# Altium schematic sheet micromicroUSBuart.SchDoc: micromicroUSBuart
size A4; DrawnBy: ftg; Engineer: ftg; Organization: Bonk.Solutions; Revision: 0; DocumentName: micromicroUSBuart; ProjectName: micromicroUSBuart
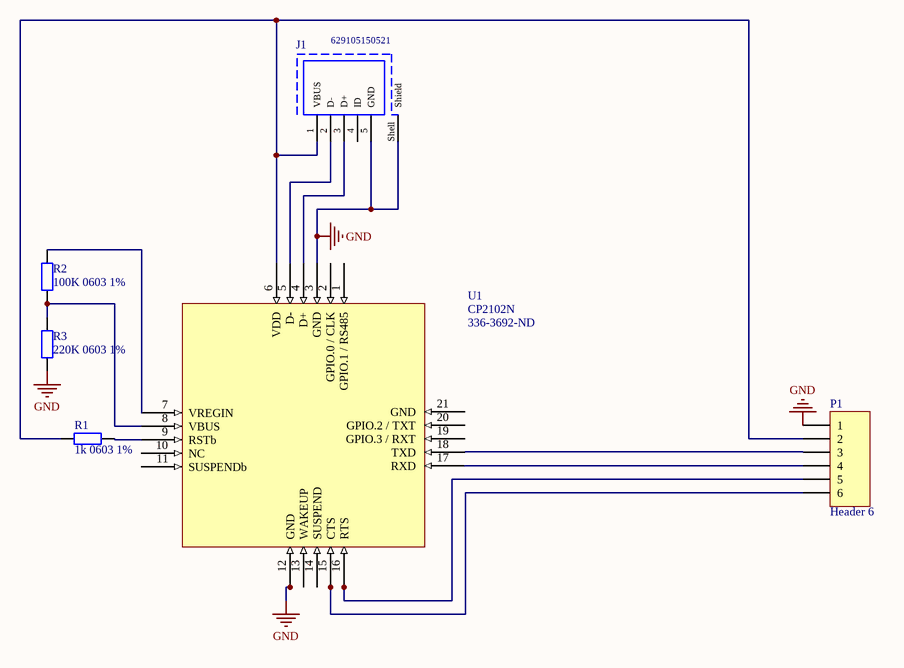
[diagram p0: micromicroUSBuart.SchDoc]

## Parts
J1  629105150521  [629105150521]
P1  Header 6  [HDR1X6]
R1  1k 0603 1%  [R0603]
R2  100K 0603 1%  [R0603]
R3  220K 0603 1%  [R0603]
U1  CP2102N  Supplier Part Number 1: 336-3692-ND  [QFN20_SILABS]

## Nets
GND: J1.5(GND) J1.Shell(Shield) P1.1 R3.1 U1.12(GND)
NetJ1_1: J1.1(VBUS) P1.2 R1.1
NetJ1_2: J1.2(D-) U1.5(D-)
NetJ1_3: J1.3(D+) U1.4(D+)
NetP1_5: P1.5 U1.16(RTS)
NetP1_6: P1.6 U1.15(CTS)
NetR2_1: R2.1 R3.2

Not connected (* = marked no-connect by the designer): J1 4(ID); P1 3 4; R1 2; R2 2; U1 1(GPIO.1_/_RS485) 2(GPIO.0_/_CLK) 3(GND) 6(VDD) 7(VREGIN) 8(VBUS) 9(RSTb) 10(NC) 11(SUSPENDb) 13(WAKEUP) 14(SUSPEND) 17(RXD) 18(TXD) 19(GPIO.3_/_RXT) 20(GPIO.2_/_TXT) 21(GND)

## Library data of the parts
J1 = 629105150521: Micro USB 2.0 Type B Receptacle WR-COM, Horizontal, SMT, with Pegs, High Current at Pin 1 & Pin 5; Rated Current: 3 A; Contact Resistance: 30 mOhm; Working Voltage: 30 VAC; ComponentLink1Description: Manufacturer; ComponentLink1URL: http://www.we-online.de; ComponentLink2Description: Datasheet; ComponentLink2URL: https://katalog.we-online.de/em/datasheet/629105150521.pdf; Part Number: 629105150521; Published Date: September 2018; Publisher: Wurth Elektronik; Orientation: Horizontal; Connector Type: Micro USB 2.0 Type B; Operating Temperature: -40 to 85 degC; Mounting Technology: SMT; Gender: Receptacle; Packaging: Tape and Reel
P1 = Header 6: Header, 6-Pin; LatestRevisionDate: 17-Jul-2002; LatestRevisionNote: Re-released for DXP Platform.; Publisher: Altium Limited
R1 = RES 1k 0603: Value: 1k; Case: 0603; Tolerance: 1%; Publisher: iv
R2 = RES 100K 0603: Value: 100K; Case: 0603; Tolerance: 1%; Publisher: iv
R3 = RES 100K 0603: 100K 0603 1%; Value: 100K; Case: 0603; Tolerance: 1%; Publisher: iv
U1 = CP2102N-QFN20: USB-UART, crystalles; Manufacturer 1: Silicon Labs; Manufacturer Part Number 1: CP2102N-A01-GQFN20; Min Supply Voltage: 3V; Max Supply Voltage: 3.6V; Supplier 1: Digi-Key; Stock 1: 13531; Pricing 1: 1=1.33, 25=1.2808, 100=1.2317, 1000=1.1526 (USD); Case/Package: QFN; Number of Pins: 20; Min Operating Temperature: -40°C; Max Operating Temperature: 85°C; REACH SVHC: Unknown; ComponentLink1URL: http://www.farnell.com/datasheets/2060533.pdf; ComponentLink1Description: http://www.farnell.com/datasheets/2060533.pdf; ComponentLink2URL: http://www.farnell.com/datasheets/2245279.pdf; ComponentLink2Description: http://www.farnell.com/datasheets/2245279.pdf; ComponentLink3URL: http://www.silabs.com/documents/public/data-sheets/cp2102n-datasheet.pdf; ComponentLink3Description: http://www.silabs.com/documents/public/data-sheets/cp2102n-datasheet.pdf